# EAGLE design wifi-carrier (EAGLE 6.5.0)
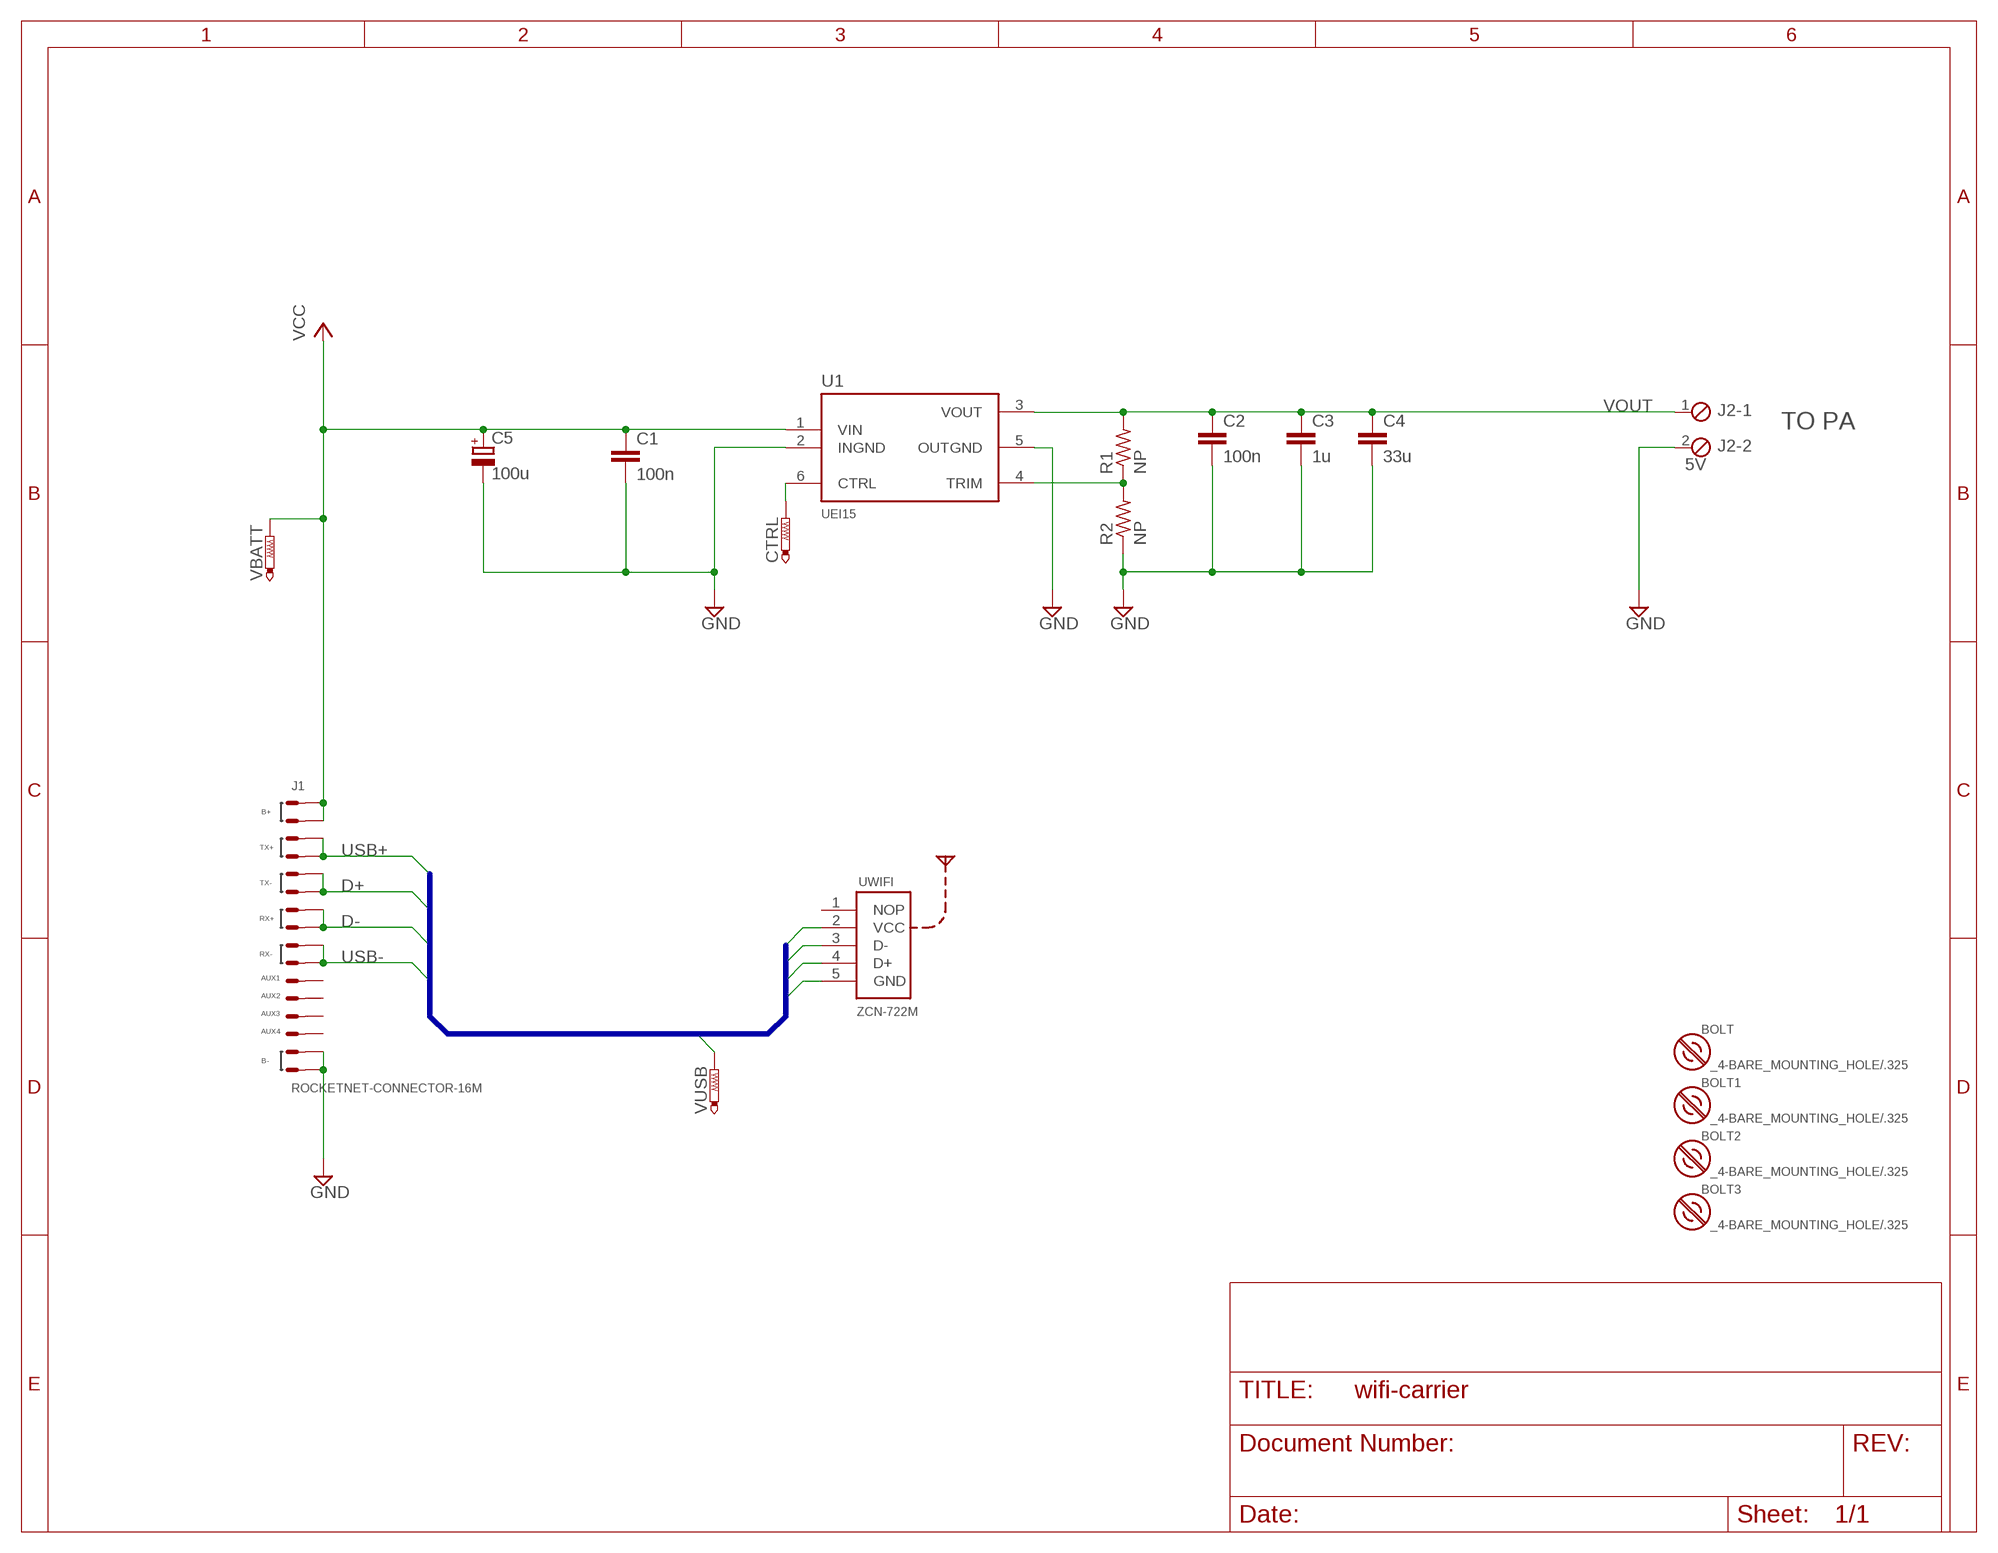
[diagram p0: schematic, sheet 1]

## Parts
BOLT  _4-BARE_MOUNTING_HOLE/.325  [_4/.325-BARE+SMALL_TOOL_CLEARANCE]
BOLT1  _4-BARE_MOUNTING_HOLE/.325  [_4/.325-BARE+SMALL_TOOL_CLEARANCE]
BOLT2  _4-BARE_MOUNTING_HOLE/.325  [_4/.325-BARE+SMALL_TOOL_CLEARANCE]
BOLT3  _4-BARE_MOUNTING_HOLE/.325  [_4/.325-BARE+SMALL_TOOL_CLEARANCE]
C1  100n  C-EUC0603  [C0603]
C2  100n  C-EUC0603  [C0603]
C3  1u  C-EUC0805  [C0805]
C4  33u  C-EUC1206  [C1206]
C5  100u  C-POL-7660  [7660]
CTRL  PTR1PAD1-13  [P1-13]
J1  ROCKETNET-CONNECTOR-16M  [ROCKETNET-M-16]
J2  5V  MPT2  [2POL254]
R1  NP  R-US_R0603  [R0603]
R2  NP  R-US_R0603  [R0603]
U1  UEI15  [UEI15_PIN]
UWIFI  ZCN-722M  [ZCN-722M]
VBATT  PTR1PAD1-13  [P1-13]
VUSB  PTR1PAD1-13  [P1-13]

## Nets
CTRL: CTRL.TP U1.6(CTRL)
D+: J1.T-@9(TX-) J1.T-@11(TX-) UWIFI.4(D+)
D-: J1.R+@5(RX+) J1.R+@7(RX+) UWIFI.3(D-)
GND: C1.2 C2.2 C3.2 C4.2 C5.- J1.B-@1(B-) J1.B-@2(B-) J2.2 R2.1 U1.2(INGND) U1.5(OUTGND)
TRIM: R1.1 R2.2 U1.4(TRIM)
USB+: J1.T+@13(TX+) J1.T+@14(TX+) UWIFI.2(VCC) VUSB.TP
USB-: J1.R-@3(RX-) J1.R-@4(RX-) UWIFI.5(GND)
VCC: C1.1 C5.+ J1.B+@15(B+) J1.B+@16(B+) U1.1(VIN) VBATT.TP
VOUT: C2.1 C3.1 C4.1 J2.1 R1.2 U1.3(VOUT)
Unconnected: J1.A1(AUX1) J1.A2(AUX2) J1.A3(AUX3) J1.A4(AUX4) UWIFI.1(NOP)

## Buses
USB-,USB+,D+,D-

## Notes on the sheet
- TO PA

## Library data of the parts
BOLT BOLT1-BOLT3 = mount-2:_4-BARE_MOUNTING_HOLE: 1/8" drill hole for #4 screw mount
C1-C4 = rcl:C-EU: CAPACITOR, European symbol
C5 = cap-3024-7660:C-POL-7660
CTRL VBATT VUSB = testpad:PTR1: TEST PIN
J1 = rocketnet-connector:ROCKETNET-CONNECTOR-16
J2 = con-phoenix-254:MPT2: PHOENIX CONNECTOR; OC_FARNELL: unknown; OC_NEWARK: unknown
R1 R2 = rcl:R-US_: RESISTOR, American symbol
U1 = wifi-carrier:UEI15: Isolated Wide Input Range 15-Watt DC/DC Converter
UWIFI = wifi-carrier:ZCN-722M: ZCN-722M USB WiFi Module High-speed Wireless-N (802.11n draft 5.0 ) networking Comply with IEEE802.11b/g

## Board
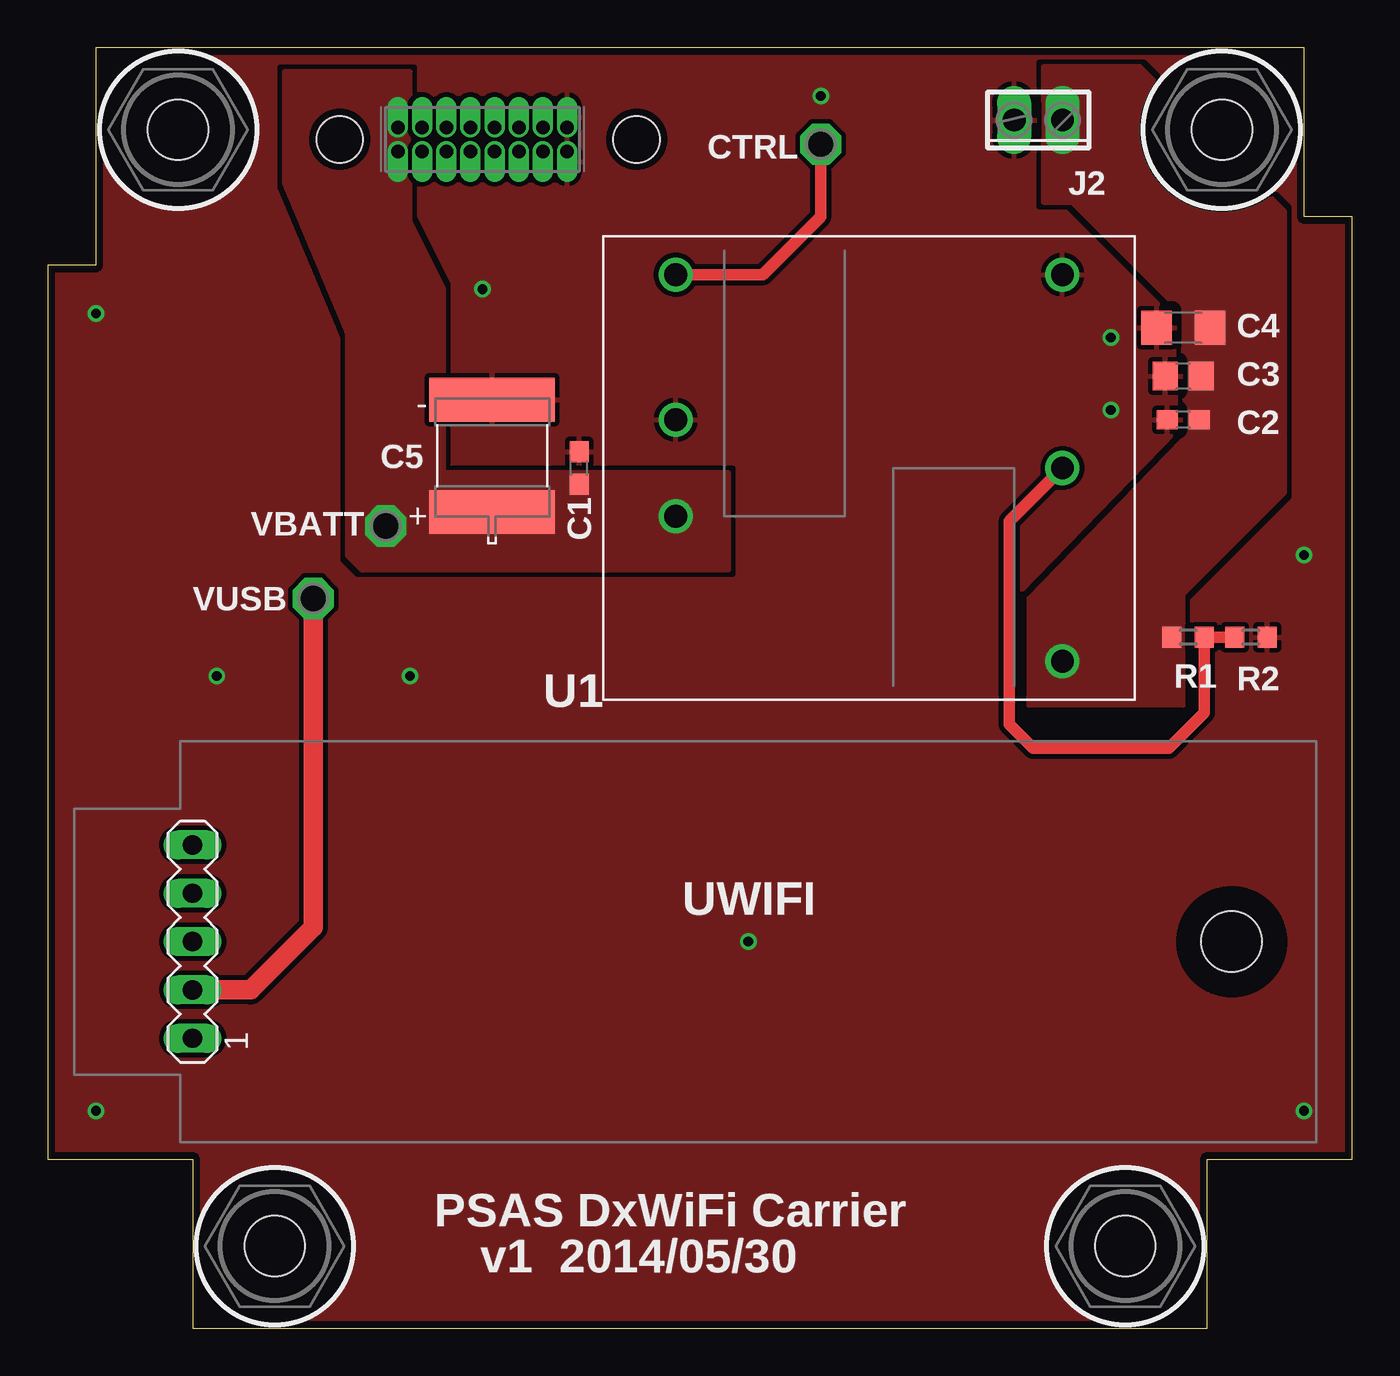
[diagram p1: board, top side]
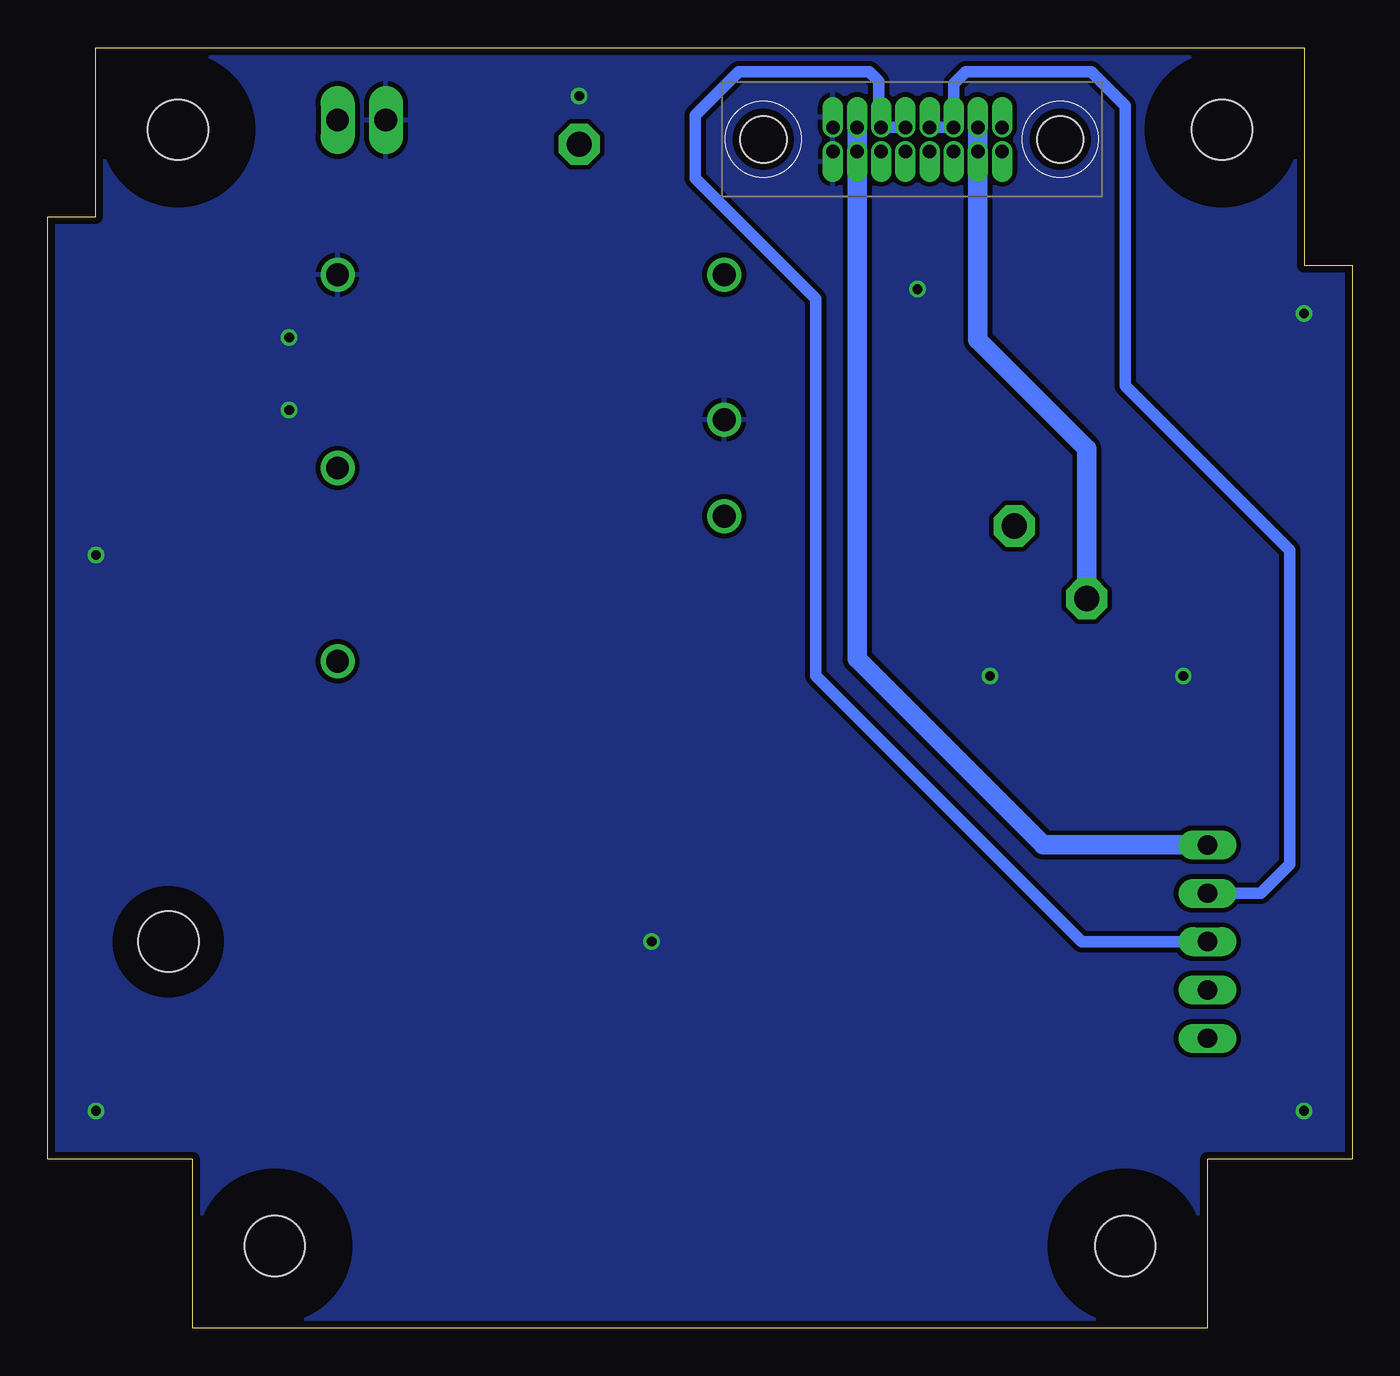
[diagram p2: board, bottom side, seen from below]

Size 68.58 x 67.31 mm. Coordinates in mm from the lower left corner, seen from the top.
Outline: 7.62,0 60.96,0 60.96,8.89 68.58,8.89 68.58,58.42 66.04,58.42 66.04,67.31 2.54,67.31 2.54,55.88 0,55.88 0,8.89 7.62,8.89 7.62,0
Copper layers (1*16): Top 0.0356mm / dielectric 1.5011mm / Bottom 0.0356mm
Design rules "LaenPCBOrder": minimum track width 6mil, minimum drill 13mil, track to track 6mil, track to pad 6mil, pad to pad 6mil, via to via 6mil, smd to smd 6mil, copper to edge 15mil, drill to drill 6mil, minimum pad ring 7mil, minimum via ring 7mil, stop-mask expansion 3mil, vias tented up to drill 0mil, thermal gap 10mil
bRestrict: area 3.2,59.3 to 10.5,66.7; area 8.3,0.6 to 15.6,8; area 53,0.6 to 60.3,8; area 58,59.3 to 65.4,66.7

### Footprints (pad centres in the part's own frame; a part is rotated, then mirrored left to right if it is on the bottom)
_4/.325-BARE+SMALL_TOOL_CLEARANCE = hole 3.175: 0,0
C0603 = smd 1.1 x 1: 1 -0.85,0; 2 0.85,0
C0805 = smd 1.3 x 1.5: 1 -0.95,0; 2 0.95,0
C1206 = smd 1.6 x 1.8: 1 -1.4,0; 2 1.4,0
7660 = smd 6.6 x 2.3: + 0,2.95; - 0,-2.95
P1-13 = drill 1.321 pad 2.159 octagon: TP 0,0
ROCKETNET-M-16 = drill 0.71 pad 0.95 offset: A1 -1.905,0.635; A2 -0.635,0.635; A3 0.635,0.635; A4 1.905,0.635; B+@15 4.445,-0.635; B+@16 4.445,0.635; B-@1 -4.445,-0.635; B-@2 -4.445,0.635; R+@5 -1.905,-0.635; R+@7 -0.635,-0.635; R-@3 -3.175,-0.635; R-@4 -3.175,0.635; T+@13 3.175,-0.635; T+@14 3.175,0.635; T-@9 0.635,-0.635; T-@11 1.905,-0.635 | hole 2.438: 7.5,0; -8.1,0
2POL254 = drill 1.2 long: 1 -1.27,0; 2 1.27,0
R0603 = smd 1 x 1.1: 1 -0.85,0; 2 0.85,0
UEI15_PIN = drill 1.194: 1 -10.16,-2.54; 2 -10.16,2.54; 3 10.16,-10.16; 4 10.16,0; 5 10.16,10.16; 6 -10.16,10.16
ZCN-722M = drill 1.016 long: 1 -29.21,-5.08; 2 -29.21,-2.54; 3 -29.21,0; 4 -29.21,2.54; 5 -29.21,5.08 | hole 3.175: 25.4,0

### Placement (x,y rotation side)
BOLT  56.64,4.32 0 top
BOLT1  11.94,4.32 0 top
BOLT2  61.72,62.99 0 top
BOLT3  6.86,62.99 0 top
C1  27.94,45.21 90 top
C2  59.69,47.75 180 top
C3  59.69,50.04 180 top
C4  59.69,52.58 180 top
C5  23.37,45.85 180 top
CTRL  40.64,62.23 0 top
J1  22.86,62.48 180 top
J2  52.07,63.5 180 top
R1  59.94,36.32 180 top
R2  63.25,36.32 180 top
U1  43.18,45.21 0 top
UWIFI  36.83,20.32 0 top
VBATT  17.78,42.16 0 top
VUSB  13.97,38.35 0 top

### Tracks (layer width: path | path; a pad name or v marks a point on that pad's centre or on a via)
CTRL
  Top 0.61: U1.6 37.59,55.37 40.64,58.42 CTRL.TP
D+
  Bottom 0.61: J1.T-@9 J1.T-@11 20.95,65.41 20.32,66.04 13.72,66.04 11.94,64.26 11.94,49.53 3.3,40.89 3.3,24.38 4.83,22.86 UWIFI.4
D-
  Bottom 0.61: J1.R+@7 J1.R+@5 24.89,63.25 24.89,65.53 25.4,66.04 32.26,66.04 34.54,63.75 34.54,60.45 28.19,54.1 28.19,34.29 14.22,20.32 UWIFI.3
GND  (via drill 0.51)
  other vias: 2.54,53.34 2.54,11.43 66.04,11.43 66.04,40.64 40.64,64.77 55.88,52.07 55.88,48.26 36.83,20.32 19.05,34.29 8.89,34.29 22.86,54.61
  pour Bottom (isolate 0.254): 0,0 0,68.58 68.58,68.58 68.58,0
  pour Top (isolate 0.254, rank 2): 0,0 0,68.58 68.58,68.58 68.58,0
TRIM
  Top 0.61: R2.2 R1.1 60.79,32.35 58.93,30.48 51.82,30.48 50.55,31.75 50.55,42.42 U1.4
USB+
  Top 1.016: VUSB.TP 13.97,21.08 10.67,17.78 UWIFI.2
  Bottom 1.016: J1.T+@13 J1.T+@14 19.68,51.94 13.97,46.23 VUSB.TP
USB-
  Bottom 1.016: J1.R-@3 J1.R-@4 26.04,35.18 16.26,25.4 UWIFI.5
VCC
  pour Top (isolate 0.254, no thermals): 19.05,58.17 19.05,66.04 12.45,66.04 12.45,60.2 15.75,52.32 15.75,40.64 16.51,39.88 35.81,39.88 35.81,44.96 20.83,44.96 20.83,54.61
VOUT
  Top 1.016: 53.34,62.23 J2.1
  pour Top (isolate 0.508, no thermals): 51.56,38.35 51.56,32.77 59.69,32.77 59.69,38.61 65.02,43.94 65.02,58.67 57.4,66.29 52.32,66.29 52.32,59.18 53.85,59.18 59.69,53.34 59.69,46.74

### Text on the board
tPlace: PSAS DxWiFi Carrier | v1 2014/05/30